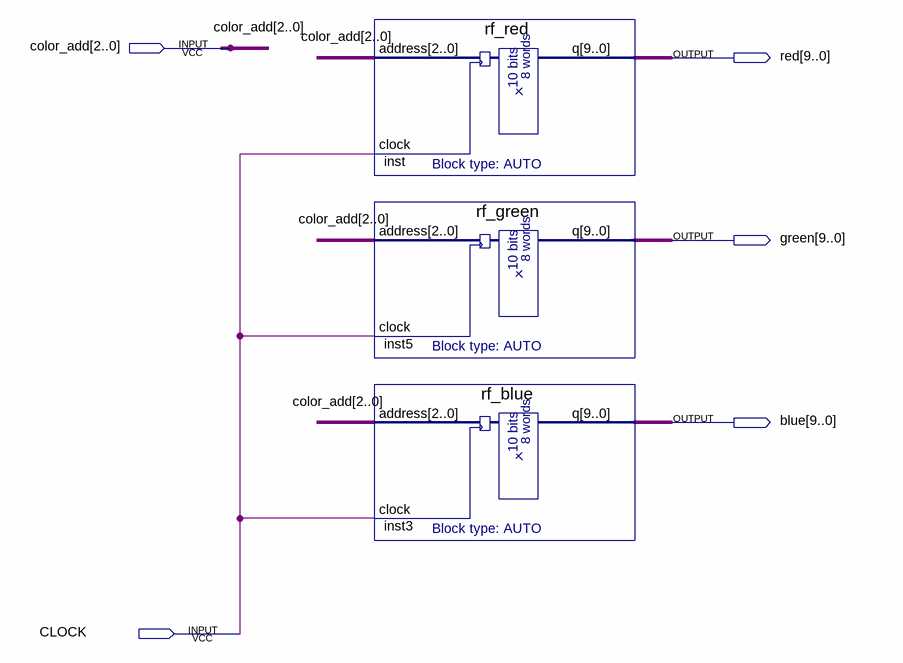
[diagram p0: schematic sheet]
// Quartus schematic Decoder.bdf as structural Verilog: 3 symbols, 5 pins
module Decoder (
  input  [2:0] color_add,
  input  CLOCK,
  output [9:0] red,
  output [9:0] green,
  output [9:0] blue
);

  rf_red inst (.address(color_add), .clock(CLOCK), .q(red));
  rf_green inst5 (.address(color_add), .clock(CLOCK), .q(green));
  rf_blue inst3 (.address(color_add), .clock(CLOCK), .q(blue));
endmodule
